# Altium project equalizerAndVoltageControl.PrjPcb
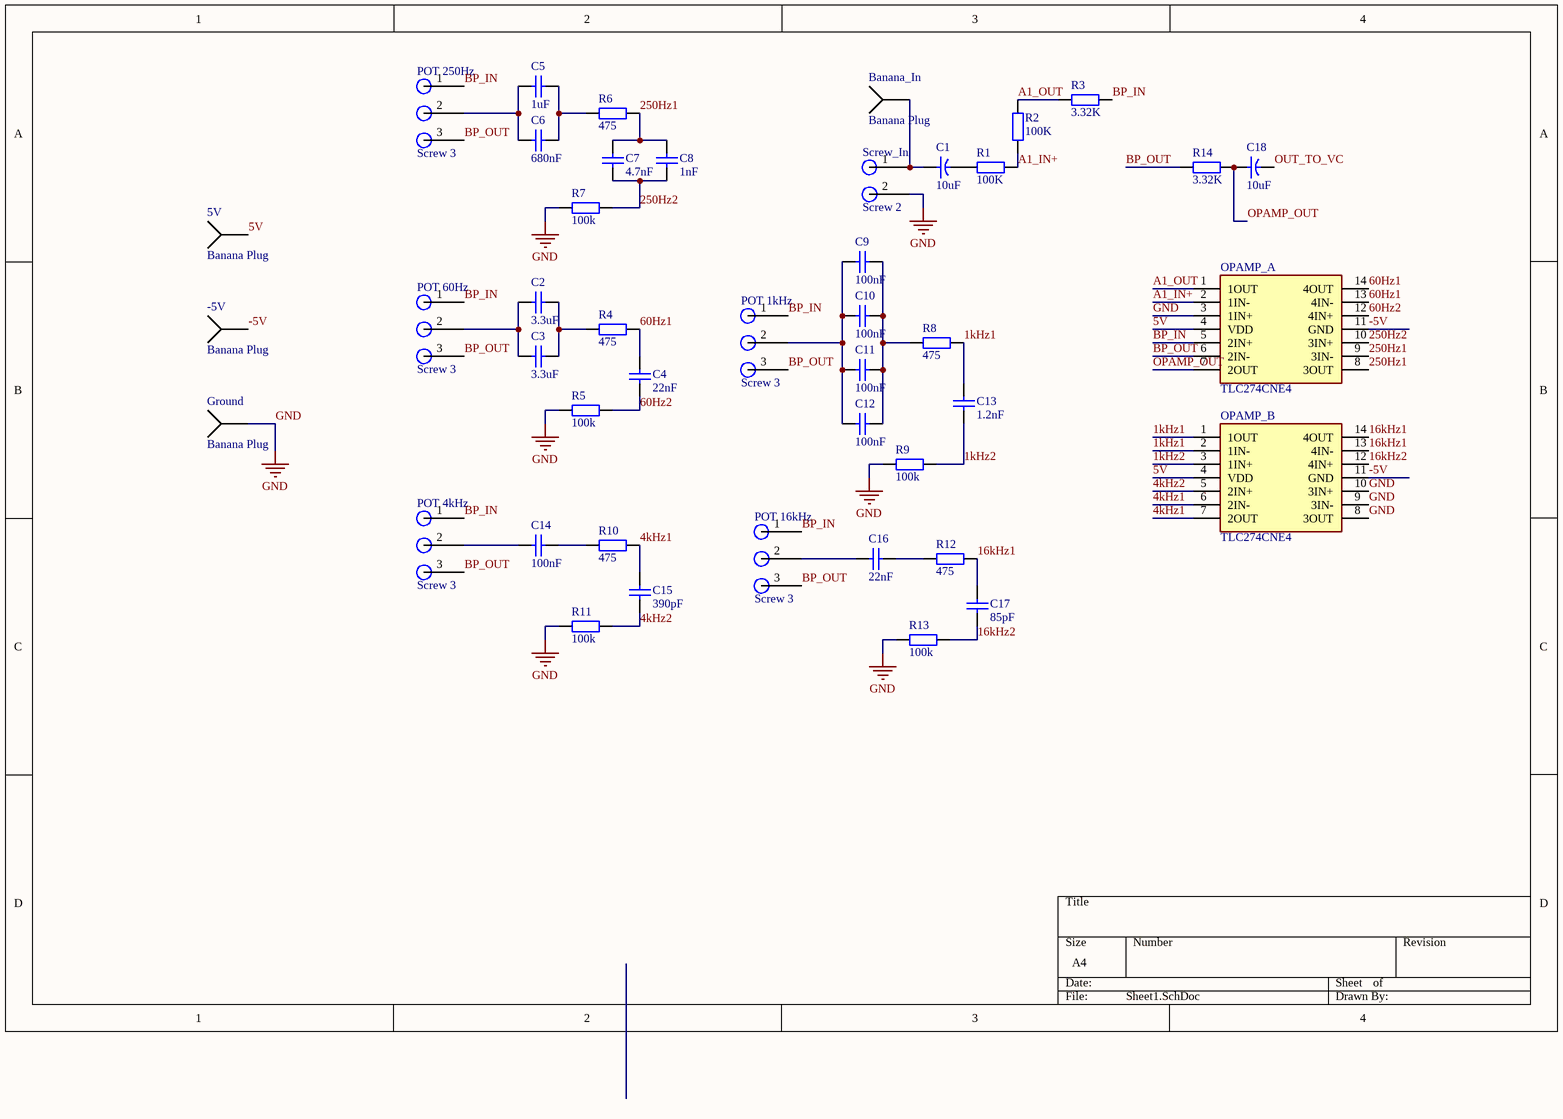
[diagram p0: Sheet1.SchDoc]
1 sheet, 44 parts. Net scope: global (net labels, ports and power ports of the same name join across sheets).

## Sheet Sheet1.SchDoc
size A4; SheetNumber: 1; SheetTotal: 1

### Parts
5V  Banana Plug  [Banana Plug On top]
-5V  Banana Plug  [Banana Plug On top]
Banana_In  Banana Plug  [Banana Plug On top]
C1  Capacity: 10uF  [RES THT 9mm]  (hidden comment: Cap)
C2  Capacity: 3.3uF  [Cap 20mm]  (hidden comment: Cap)
C3  Capacity: 3.3uF  [Cap 20mm]  (hidden comment: Cap)
C4  Capacity: 22nF  [Cap-1]  (hidden comment: Cap)
C5  Capacity: 1uF  [Cap-1]  (hidden comment: Cap)
C6  Capacity: 680nF  [Cap-1]  (hidden comment: Cap)
C7  Capacity: 4.7nF  [Cap-0]  (hidden comment: Cap)
C8  Capacity: 1nF  [Cap-0]  (hidden comment: Cap)
C9  Capacity: 100nF  [Cap-1]  (hidden comment: Cap)
C10  Capacity: 100nF  [Cap-1]  (hidden comment: Cap)
C11  Capacity: 100nF  [Cap-1]  (hidden comment: Cap)
C12  Capacity: 100nF  [Cap-1]  (hidden comment: Cap)
C13  Capacity: 1.2nF  [Cap-1]  (hidden comment: Cap)
C14  Capacity: 100nF  [Cap 20mm]  (hidden comment: Cap)
C15  Capacity: 390pF  [Cap-0]  (hidden comment: Cap)
C16  Capacity: 22nF  [Cap 20mm]  (hidden comment: Cap)
C17  Capacity: 85pF  [Cap-0]  (hidden comment: Cap)
C18  Capacity: 10uF  [RES THT 9mm]  (hidden comment: Cap)
Ground  Banana Plug  [Banana Plug On top]
OPAMP_A  TLC274CNE4  [DIP794W53P254L1930H508Q14N]
OPAMP_B  TLC274CNE4  [DIP794W53P254L1930H508Q14N]
POT_1kHz  Screw 3  [Screw-3]
POT_4kHz  Screw 3  [Screw-3]
POT_16kHz  Screw 3  [Screw-3]
POT_60Hz  Screw 3  [Screw-3]
POT_250Hz  Screw 3  [Screw-3]
R1  Ohm: 100K  [RES SMD 0201]  (hidden comment: Resistor)
R2  Ohm: 100K  [RES SMD 0201]  (hidden comment: Resistor)
R3  Ohm: 3.32K  [RES SMD 0201]  (hidden comment: Resistor)
R4  Ohm: 475  [RES SMD 0201]  (hidden comment: Resistor)
R5  Ohm: 100k  [RES SMD 0201]  (hidden comment: Resistor)
R6  Ohm: 475  [RES SMD 0201]  (hidden comment: Resistor)
R7  Ohm: 100k  [RES SMD 0201]  (hidden comment: Resistor)
R8  Ohm: 475  [RES SMD 0201]  (hidden comment: Resistor)
R9  Ohm: 100k  [RES SMD 0201]  (hidden comment: Resistor)
R10  Ohm: 475  [RES SMD 0201]  (hidden comment: Resistor)
R11  Ohm: 100k  [RES SMD 0201]  (hidden comment: Resistor)
R12  Ohm: 475  [RES SMD 0201]  (hidden comment: Resistor)
R13  Ohm: 100k  [RES SMD 0201]  (hidden comment: Resistor)
R14  Ohm: 3.32K  [RES SMD 0201]  (hidden comment: Resistor)
Screw_In  Screw 2  [Screw-2]

### Nets
GND: Ground.1 OPAMP_A.3(1IN+) OPAMP_B.8(3OUT) OPAMP_B.9(3IN-) OPAMP_B.10(3IN+) R5.1 R7.1 R9.1 R11.1 R13.1 Screw_In.2
1kHz1: C13.2(g) OPAMP_B.1(1OUT) OPAMP_B.2(1IN-) R8.2
1kHz2: C13.1 OPAMP_B.3(1IN+) R9.2
4kHz1: C15.2(g) OPAMP_B.6(2IN-) OPAMP_B.7(2OUT) R10.2
4kHz2: C15.1 OPAMP_B.5(2IN+) R11.2
5V: 5V.1 OPAMP_A.4(VDD) OPAMP_B.4(VDD)
16kHz1: C17.2(g) OPAMP_B.13(4IN-) OPAMP_B.14(4OUT) R12.2
16kHz2: C17.1 OPAMP_B.12(4IN+) R13.2
60Hz1: C4.2(g) OPAMP_A.13(4IN-) OPAMP_A.14(4OUT) R4.2
60Hz2: C4.1 OPAMP_A.12(4IN+) R5.2
250Hz1: C7.2(g) C8.2(g) OPAMP_A.8(3OUT) OPAMP_A.9(3IN-) R6.2
250Hz2: C7.1 C8.1 OPAMP_A.10(3IN+) R7.2
-5V: -5V.1 OPAMP_A.11(GND) OPAMP_B.11(GND)
A1_IN+: OPAMP_A.2(1IN-) R1.2 R2.1
A1_OUT: OPAMP_A.1(1OUT) R2.2 R3.2
BP_IN: OPAMP_A.5(2IN+) POT_1kHz.1 POT_4kHz.1 POT_16kHz.1 POT_60Hz.1 POT_250Hz.1 R3.1
BP_OUT: OPAMP_A.6(2IN-) POT_1kHz.3 POT_4kHz.3 POT_16kHz.3 POT_60Hz.3 POT_250Hz.3 R14.2
OPAMP_OUT: C18.1 OPAMP_A.7(2OUT) R14.1
OUT_TO_VC: C18.2(g)
NetBanana_In_1: Banana_In.1 C1.1 Screw_In.1
NetC1_2: C1.2(g) R1.1
NetC2_1: C2.1 C3.1 POT_60Hz.2
NetC2_2: C2.2(g) C3.2(g) R4.1
NetC5_1: C5.1 C6.1 R6.1
NetC5_2: C5.2(g) C6.2(g) POT_250Hz.2
NetC9_1: C9.1 C10.1 C11.1 C12.1 POT_1kHz.2
NetC9_2: C9.2(g) C10.2(g) C11.2(g) C12.2(g) R8.1
NetC14_1: C14.1 POT_4kHz.2
NetC14_2: C14.2(g) R10.1
NetC16_1: C16.1 POT_16kHz.2
NetC16_2: C16.2(g) R12.1

### Library data of the parts
C1 C18 = Capacitor Polarised
C2 C3 C14 C16 = Capacitor big ceramic
C4-C6 C9-C13 = Capacitor 1 space
C7 C8 C15 C17 = Capacitor 0 space
OPAMP_A OPAMP_B = TLC274CNE4: Precision Amplifiers Quad Single Supply Op Amp; Manufacturer_Name: Texas Instruments; Geometry.Height: 5.08mm; Mouser Part Number: 595-TLC274CNE4; Mouser Price/Stock: https://www.mouser.co.uk/ProductDetail/Texas-Instruments/TLC274CNE4?qs=Mkt%2FZhxPIiTvMsNXR1cCkw%3D%3D; Manufacturer_Part_Number: TLC274CNE4; Datasheet Link: https://www.ti.com/lit/ds/symlink/tlc274.pdf?ts=1639464334605&ref_url=https%253A%252F%252Fwww.ti.com%252Fstore%252Fti%252Fen%252Fp%252Fproduct%252F%253Fp%253DTLC274CN